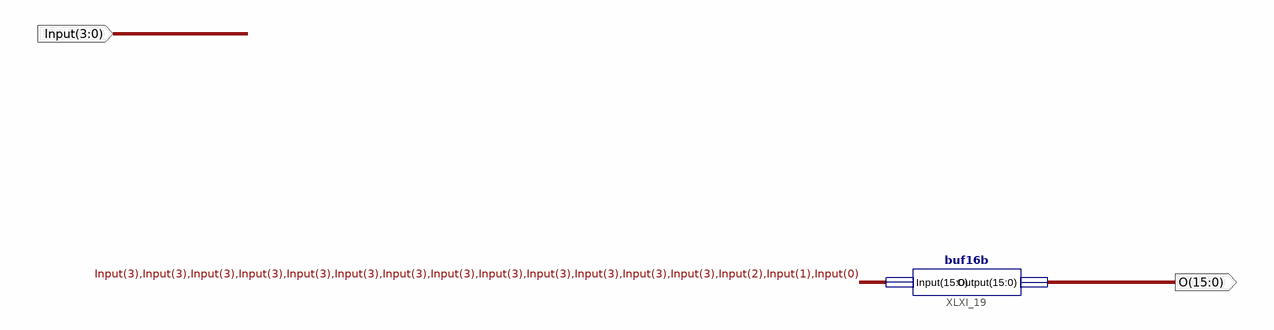
[diagram p0: schematic sheet 1]
// Xilinx ISE schematic signext4b16.sch (spartan3e) as structural Verilog: 1 symbols, 2 ports
module signext4b16 (
  input  [3:0] Input,
  output [15:0] O
);

  buf16b XLXI_19 (.Input({{13{Input[3]}}, Input[2:0]}), .Output(O));
endmodule
